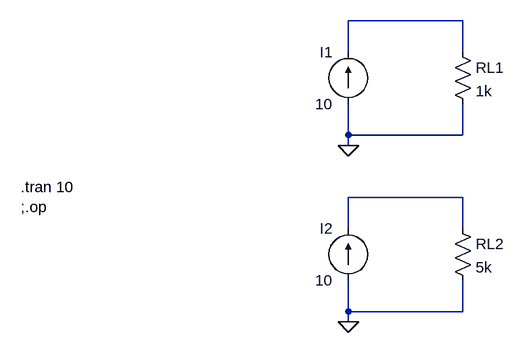
[diagram p0: schematic circuit.asc]
circuit.asc, the LTspice schematic file:
Version 4.1
SHEET 1 880 680
WIRE 224 80 48 80
WIRE 48 128 48 80
WIRE 224 128 224 80
WIRE 48 256 48 208
WIRE 224 256 224 208
WIRE 224 256 48 256
WIRE 48 272 48 256
WIRE 224 352 48 352
WIRE 48 400 48 352
WIRE 224 400 224 352
WIRE 48 528 48 480
WIRE 224 528 224 480
WIRE 224 528 48 528
WIRE 48 544 48 528
FLAG 48 272 0
FLAG 48 544 0
DATAFLAG 208 80 ""
DATAFLAG 192 352 ""
DATAFLAG 224 384 "I(RL2)"
DATAFLAG 176 224 "I(RL1)"
SYMBOL current 48 208 R180
WINDOW 0 24 80 Left 2
WINDOW 3 24 0 Left 2
WINDOW 123 0 0 Left 0
WINDOW 39 0 0 Left 0
SYMATTR InstName I1
SYMATTR Value 10
SYMBOL res 208 112 R0
SYMATTR InstName RL1
SYMATTR Value 1k
SYMBOL current 48 480 R180
WINDOW 0 24 80 Left 2
WINDOW 3 24 0 Left 2
WINDOW 123 0 0 Left 0
WINDOW 39 0 0 Left 0
SYMATTR InstName I2
SYMATTR Value 10
SYMBOL res 208 384 R0
SYMATTR InstName RL2
SYMATTR Value 5k
TEXT -456 336 Left 2 !.tran 10\n;.op

The netlist it stands for:
* circuit.asc
I1 0 N001 10
RL1 N001 0 1k
I2 0 N002 10
RL2 N002 0 5k
.tran 10
;.op
.backanno
.end